# Altium schematic sheet Sheet4.SchDoc
size A4; SheetNumber: 1; SheetTotal: 1
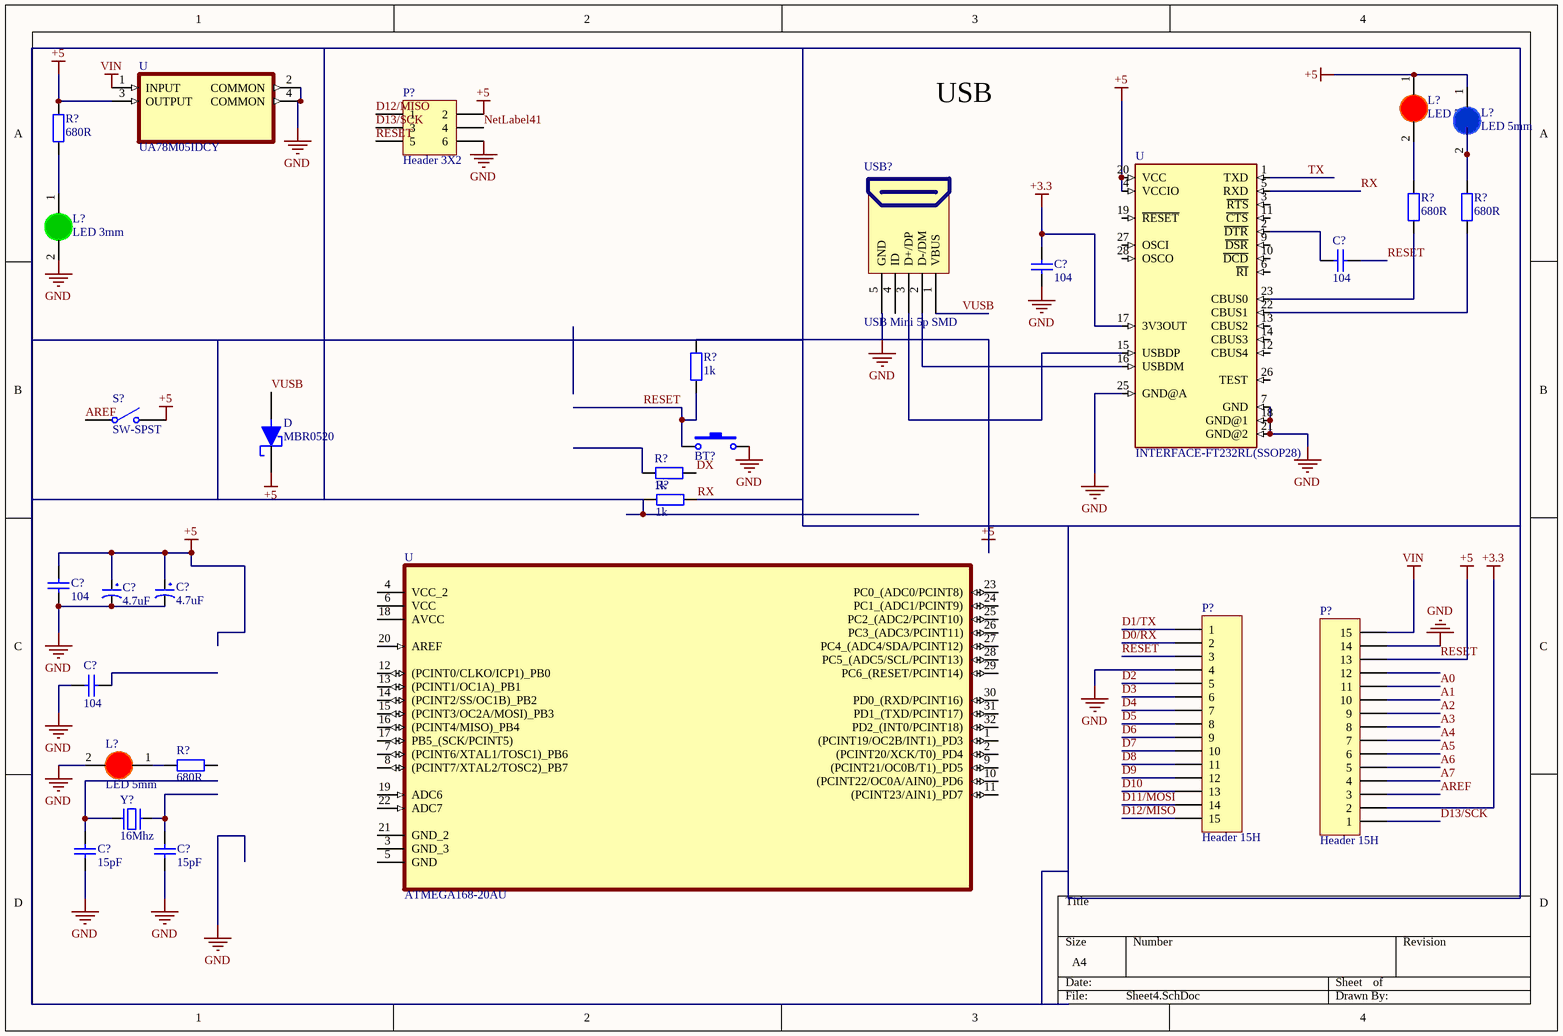
[diagram p0: Sheet4.SchDoc]

## Parts
(Parts that share a designator on the sheet are numbered #1, #2 ... from top to bottom, then left to right.)
BT?  Nut Nhan 2 Chan SMD 3x6x2.5  [Nut Nhan 2 Chan SMD 3x6x2.5]  (value not drawn)
C?#1  104  [tu 0805]
C?#2  104  [tu 0805]
C?#3  104  [tu 0805]
C?#4  4.7uF  [tu hoa 5mm]
C?#5  4.7uF  [tu hoa 5mm]
C?#6  104  [tu 0805]
C?#7  15pF  [tu 0805]
C?#8  15pF  [tu 0805]
D  MBR0520  [SOD-123]
L?#1  LED 5mm  [LED-5MM-RED]
L?#2  LED 5mm  [LED-5MM-BLUE]
L?#3  LED 3mm  [LED-3MM-GREEN]
L?#4  LED 5mm  [LED-5MM-RED]
P?#1  Header 3X2  [HDR2X3]
P?#2  Header 15H  [HDR1X15H]
P?#3  Header 15H  [HDR1X15H]
R?#1  680R  [Tro SMD 0805]
R?#2  680R  [tro smd 0805]
R?#3  680R  [tro smd 0805]
R?#4  1k  [tro smd 0805]
R?#5  1k  [tro smd 0805]
R?#6  1k  [tro smd 0805]
R?#7  680R  [Tro SMD 0805]
S?  SW-SPST  [SPST-2]
U#1  UA78M05IDCY  [SOT230P700X180-4N]
U#2  INTERFACE-FT232RL(SSOP28)  [SSOP28-0.65-10.2X5.2MM]
U#3  ATMEGA168-20AU  [QFP80P900X900X120-32N]
USB?  USB Mini 5p SMD  [USB Mini 5p SMD]
Y?  16Mhz  [Thach Anh 2 chan cam]

## Nets
+3.3: C?#2.2 P?#3.2 U#2.17(3V3OUT)
GND: BT?.2 C?#2.1 C?#3.1 C?#4.2 C?#5.2 C?#6.2 C?#7.1 C?#8.1 L?#3.2(K) L?#4.2(K) P?#1.6 P?#2.4 P?#3.14 U#1.2(COMMON) U#1.4(COMMON) U#2.7(GND) U#2.18(GND@1) U#2.21(GND@2) U#2.25(GND@A) USB?.5(GND)
RESET: BT?.1 C?#1.1 C?#3.2 C?#4.1 C?#5.1 D.1(CA) L?#1.1(A) L?#2.1(A) P?#1.2 P?#1.5 P?#2.3 P?#3.13 R?#1.1 R?#4.1 R?#4.2 S?.2(NO) U#1.3(OUTPUT) U#2.4(VCCIO) U#2.20(VCC)  [also labelled +5]
VIN: P?#3.15 U#1.1(INPUT)
A0: P?#3.11
A1: P?#3.10
A2: P?#3.9
A3: P?#3.8
A4: P?#3.7
A5: P?#3.6
A6: P?#3.5
A7: P?#3.4
AREF: P?#3.3 S?.1(COMMON)
D0/RX: P?#2.2
D1/TX: P?#2.1
D2: P?#2.5
D3: P?#2.6
D4: P?#2.7
D5: P?#2.8
D6: P?#2.9
D7: P?#2.10
D8: P?#2.11
D9: P?#2.12
D10: P?#2.13
D11/MOSI: P?#2.14
D12/MISO: P?#1.1 P?#2.15
D13/SCK: P?#1.3 P?#3.1
DX: R?#5.2
NetLabel41: P?#1.4
RX: U#2.5(RXD)
TX: U#2.1(TXD)
VUSB: D.2(AN) USB?.1(VBUS)
NetC?#1_2: C?#1.2 U#2.2(~{DTR})
NetC?#7_2: C?#7.2 Y?.1
NetC?#8_2: C?#8.2 Y?.2
NetL?#1_2: L?#1.2(K) R?#2.1
NetL?#2_2: L?#2.2(K) R?#3.1
NetL?#3_1: L?#3.1(A) R?#1.2
NetL?#4_1: L?#4.1(A) R?#7.1
NetR?#2_2: R?#2.2 U#2.23(CBUS0)
NetR?#3_2: R?#3.2 U#2.22(CBUS1)
NetU#2_15: U#2.15(USBDP) USB?.3(D+/DP)
NetU#2_16: U#2.16(USBDM) USB?.2(D-/DM)

Not connected (* = marked no-connect by the designer): C?#6 1; P?#3 12; R?#5 1; R?#6 1 2; R?#7 2; U#2 3(~{RTS}) 6(~{RI}) 9(~{DSR}) 10(~{DCD}) 11(~{CTS}) 12(CBUS4) 13(CBUS2) 14(CBUS3) 19(~{RESET}) 26(TEST) 27(OSCI) 28(OSCO); U#3 1((PCINT19/OC2B/INT1)_PD3) 2((PCINT20/XCK/T0)_PD4) 3(GND_3) 4(VCC_2) 5(GND) 6(VCC) 7((PCINT6/XTAL1/TOSC1)_PB6) 8((PCINT7/XTAL2/TOSC2)_PB7) 9((PCINT21/OC0B/T1)_PD5) 10((PCINT22/OC0A/AIN0)_PD6) 11((PCINT23/AIN1)_PD7) 12((PCINT0/CLKO/ICP1)_PB0) 13((PCINT1/OC1A)_PB1) 14((PCINT2/SS/OC1B)_PB2) 15((PCINT3/OC2A/MOSI)_PB3) 16((PCINT4/MISO)_PB4) 17(PB5_(SCK/PCINT5)) 18(AVCC) 19(ADC6) 20(AREF) 21(GND_2) 22(ADC7) 23(PC0_(ADC0/PCINT8)) 24(PC1_(ADC1/PCINT9)) 25(PC2_(ADC2/PCINT10)) 26(PC3_(ADC3/PCINT11)) 27(PC4_(ADC4/SDA/PCINT12)) 28(PC5_(ADC5/SCL/PCINT13)) 29(PC6_(RESET/PCINT14)) 30(PD0_(RXD/PCINT16)) 31(PD1_(TXD/PCINT17)) 32(PD2_(INT0/PCINT18)); USB? 4(ID)

## Buses and harness runs
bus RX

## Notes on the sheet
- USB

## Library data of the parts
BT? = Nut Nhan 2 Chan SMD 3x6x2.5: Ma_Hang: MH001036; Ten: Nút Nhấn 2 Chân 3x6x2.5MM SMD
C?#1-C?#3 C?#6 = Tu 0805 104 50V 10%: Dán; Don_Vi: Con; So_Chan: 2; Ten_Linh_Kien: Tụ 0805 104-100nF 10% 50V; Ma_Hang: MH004551; Chung_Loai: Dán; Kieu_Chan: *
C?#4 C?#5 = Tu Hoa 4.7uF 50V 5x11: Cắm; Don_Vi: Con; So_Chan: 2; Ten_Linh_Kien: Tụ Hóa 4.7uF 50V 5x11MM; Ma_Hang: MH001357; Chung_Loai: Cắm; Kieu_Chan: *
C?#7 C?#8 = Tu 0805 15pF 50V 10%: Dán; Don_Vi: Con; So_Chan: 2; Ten_Linh_Kien: Tụ 0805 15P 10% 50V; Ma_Hang: MH004556; Chung_Loai: Dán; Kieu_Chan: *
D = MBR0520: Diode Schottky 20V 500mA Surface Mount SOD-123; MF: ON Semiconductor; Package: SOD-123 International Rectifier; Price: None; SnapEDA_Link: https://www.snapeda.com/parts/MBR0520/ON%20Semiconductor/view-part/564242/?ref=snap; Availability: Unavailable; Value: *; MP: MBR0520
L?#1 L?#4 = LED 5mm Do: Cắm; Don_Vi: Con; Ma_Hang: MH008967; Ten_Linh_Kien: Led 5MM Phủ Đỏ (1000c); Ghi_Chu: *; Kieu_Chan: *; Chung_Loai: Cắm
L?#2 = LED 5mm Xanh Duong: Cắm; Don_Vi: Con; Ma_Hang: MH008987; Ten_Linh_Kien: Led 5MM Xanh Dương Đục (1000c); Ghi_Chu: *; Kieu_Chan: *; Chung_Loai: Cắm
L?#3 = LED 3mm Xanh La: Cắm; Don_Vi: Con; Ma_Hang: MH001054; Ten_Linh_Kien: Led 3MM Phủ Xanh (10c); Ghi_Chu: *; Kieu_Chan: *; Chung_Loai: Cắm
P?#1 = Header 3X2: Header, 3-Pin, Dual row; LatestRevisionDate: 17-Jul-2002; LatestRevisionNote: Re-released for DXP Platform.; Publisher: Altium Limited
P?#2 P?#3 = Header 15H: Header, 15-Pin, Right Angle; LatestRevisionDate: 17-Jul-2002; LatestRevisionNote: Re-released for DXP Platform.; Publisher: Altium Limited
R?#1 R?#7 = Tro 0805 5% 680R: Dán; Don_Vi: Con; Ma_Hang: MH005344; So_Chan: 2; Ten_Linh_Kien: Trở 0805 5% 680R; Chung_Loai: Dán; Kieu_Chan: *
R?#2 R?#3 = Tro 0805 1% 680R: Dán; Don_Vi: Con; So_Chan: 2; Ten_Linh_Kien: Trở 0805 1% 680R; Ma_Hang: MH005487; Chung_Loai: Dán; Kieu_Chan: *
R?#4-R?#6 = Tro 0805 1% 1k: Dán; Don_Vi: Con; So_Chan: 2; Ten_Linh_Kien: Trở 0805 1% 1k; Ma_Hang: MH005468; Chung_Loai: Dán; Kieu_Chan: *
S? = SW-SPST: Single-Pole, Single-Throw Switch; Published: 24-Mar-1999; LatestRevisionDate: 17-Jul-2002; LatestRevisionNote: Re-released for DXP Platform.; PackageReference: SPST-2; Publisher: Altium Limited; PackageDescription: Switch; 2 Leads
U#1 = UA78M05IDCY: 500-mA, 25-V, Linear Voltage Regulators; MF: Texas Instruments; Price: None; Value: *; SnapEDA_Link: https://www.snapeda.com/parts/UA78M05IDCY/Texas%20Instruments/view-part/1101226/?ref=snap; Texas_Instruments-Purchase-URL: https://snapeda.com/shop?store=Texas+Instruments&id=1101226; Mouser-Purchase-URL: https://snapeda.com/shop?store=Mouser&id=1101226; Package: SOT-223-4 Texas Instruments; Arrow_Electronics-Purchase-URL: https://snapeda.com/shop?store=Arrow+Electronics&id=1101226; Availability: Unavailable; MP: UA78M05IDCY; DigiKey-Purchase-URL: https://snapeda.com/shop?store=DigiKey&id=1101226
U#2 = INTERFACE-FT232RL(SSOP28): USB Bridge, USB to UART USB 2.0 UART Interface 28-SSOP; MF: FTDI, Future; SnapEDA_Link: https://www.snapeda.com/parts/FT232RL/FTDI%2C%20Future%20Technology%20Devices%20International%20Ltd/view-part/1077088/?ref=snap; Package: SSOP-28 FTDI, Future; MP: FT232RL; Price: None; Value: *; Availability: Unavailable
U#3 = ATMEGA168-20AU: AVR AVRÂ® ATmega Microcontroller IC 8-Bit 20MHz 16KB _8K x 16_ FLASH 32-TQFP _7x7_; MF: Microchip; MP: ATMEGA168-20AU; Availability: Unavailable; Package: TQFP-32 Microchip; Price: None; SnapEDA_Link: https://www.snapeda.com/parts/ATMEGA168-20AU/Microchip/view-part/776709/?ref=snap; Value: *
USB? = USB Mini 5p SMD: USB Type B; Ten: MiniUSB 5P SMD; Ma_Hang: MH001022
Y? = Thach Anh 2 chan Cam: Crystal For all Crystal 2pin.; Value: 4Mhz